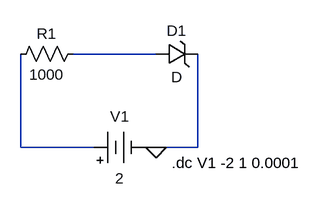
[diagram p0: schematic VI_Diode_zener_Forward.asc]
VI_Diode_zener_Forward.asc, the LTspice schematic file:
Version 4
SHEET 1 880 680
WIRE 256 112 128 112
WIRE 48 256 48 112
WIRE 160 256 48 256
WIRE 256 256 240 256
WIRE 320 256 320 112
WIRE 320 256 256 256
FLAG 256 256 0
SYMBOL res 144 96 R90
WINDOW 0 0 56 VBottom 2
WINDOW 3 32 56 VTop 2
SYMATTR InstName R1
SYMATTR Value 1000
SYMBOL Misc\\battery 144 256 R270
WINDOW 0 32 56 VTop 2
WINDOW 3 -32 56 VBottom 2
SYMATTR InstName V1
SYMATTR Value 2
SYMBOL zener 256 128 R270
WINDOW 0 36 32 VTop 2
WINDOW 3 -4 32 VBottom 2
SYMATTR InstName D1
TEXT 280 280 Left 2 !.dc V1 -2 1 0.0001

The netlist it stands for:
* VI_Diode_zener_Forward.asc
R1 N001 N002 1000
V1 N002 0 2
D1 N001 0 D
.model D D
.lib standard.dio
.dc V1 -2 1 0.0001
.backanno
.end